# Altium project Stethescope.PrjPcb
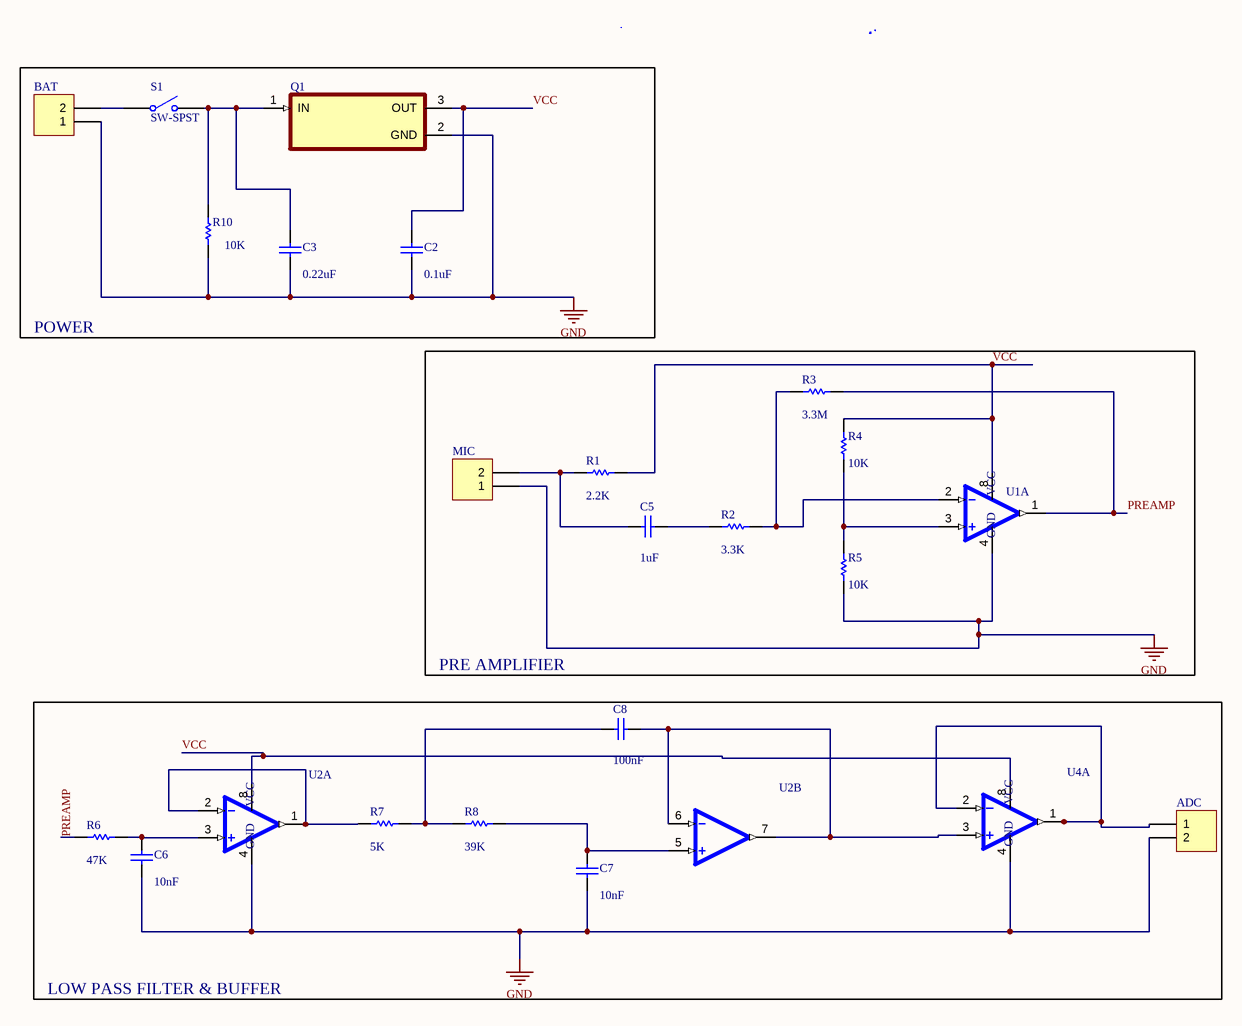
[diagram p0: Sheet1.SchDoc]
1 sheet, 23 parts. Net scope: global (net labels, ports and power ports of the same name join across sheets).
Board file: PCB1.PcbDoc

## Sheet Sheet1.SchDoc
size 420 x 297 mm; SheetNumber: 1; SheetTotal: 1

### Parts
ADC  MHDR1X2  [MHDR1X2]  (value not drawn)
BAT  MHDR1X2  [MHDR1X2]  (value not drawn)
C2  value 0.1uF  [RAD-0.3]  (hidden comment: Cap)
C3  value 0.22uF  [RAD-0.3]  (hidden comment: Cap)
C5  value 1uF  [RAD-0.3]  (hidden comment: Cap)
C6  value 10nF  [RAD-0.3]  (hidden comment: Cap)
C7  value 10nF  [RAD-0.3]  (hidden comment: Cap)
C8  value 100nF  [RAD-0.3]  (hidden comment: Cap)
MIC  MHDR1X2  [MHDR1X2]  (value not drawn)
Q1  LM7805CT/NOPB  [TO254P1054X470X1955-3]  (value not drawn)
R1  value 2.2K  [AXIAL-0.3]  (hidden comment: Res1)
R2  value 3.3K  [AXIAL-0.3]  (hidden comment: Res1)
R3  value 3.3M  [AXIAL-0.3]  (hidden comment: Res1)
R4  value 10K  [AXIAL-0.3]  (hidden comment: Res1)
R5  value 10K  [AXIAL-0.3]  (hidden comment: Res1)
R6  value 47K  [AXIAL-0.3]  (hidden comment: Res1)
R7  value 5K  [AXIAL-0.3]  (hidden comment: Res1)
R8  value 39K  [AXIAL-0.3]  (hidden comment: Res1)
R10  value 10K  [AXIAL-0.3]  (hidden comment: Res1)
S1  SW-SPST  [SPST-2]
U1  LM358N  [DIP762W46P254L960H508Q8]  (value not drawn)  (part A of 2)
U2  LM358N  [DIP762W46P254L960H508Q8]  (value not drawn)  (parts A,B of 2)
U4  LM358N  [DIP762W46P254L960H508Q8]  (value not drawn)  (part A of 2)

### Blocks framed on the sheet
POWER: BAT C2 C3 Q1 R10 S1
PRE AMPLIFIER: C5 MIC R1-R5 U1
LOW PASS FILTER & BUFFER: ADC C6-C8 R6-R8 U2 U4

### Nets
GND: ADC.2 BAT.1 C2.1 C3.1 C6.2 C7.2 MIC.1 Q1.2(GND) R5.1 R10.1 U1.4(GND) U2.4(GND) U4.4(GND)
PREAMP: R3.2 R6.1 U1.1(1OUT)
VCC: C2.2 Q1.3(OUT) R1.2 R4.2 U1.8(VCC) U2.8(VCC) U4.8(VCC)
NetADC_1: ADC.1 U4.1(1OUT) U4.2(1IN-)
NetBAT_2: BAT.2 S1.1(COMMON)
NetC3_2: C3.2 Q1.1(IN) R10.2 S1.2(NO)
NetC5_1: C5.1 R2.1
NetC5_2: C5.2 MIC.2 R1.1
NetC6_1: C6.1 R6.2 U2.3(1IN+)
NetC7_1: C7.1 R8.2 U2.5(2IN+)
NetC8_1: C8.1 U2.6(2IN-) U2.7(2OUT) U4.3(1IN+)
NetC8_2: C8.2 R7.2 R8.1
NetR2_2: R2.2 R3.1 U1.2(1IN-)
NetR4_1: R4.1 R5.2 U1.3(1IN+)
NetR7_1: R7.1 U2.1(1OUT) U2.2(1IN-)

### Notes on the sheet
- THIS DOCUMENT AND THE DATA DISCLOSED HEREIN OR
- HEREWITH IS THE PROPERTY OF ALTIUM LIMITED AND MAY
- DWG NO:
- REVISION
- REV:
- DESCRIPTION
- DATE
- APPROVED
- BE FREELY DISTRIBUTED IN WHOLE. NO RIGHTS ARE
- RESERVED OR EXPRESS OR IMPLIED WARANTEE GIVEN.
- ENG:
- APPROVALS
- PROJECT
- DSN:
- CHK:
- REFERENCE DOCUMENTS
- PROJECT REVISION:
- TITLE
- DOCUMENT REVISION:
- DESIGN ITEM:
- BOM:
- FAB DWG:
- PCB DWG:
- ASSY DWG:
- SCALE:
- A3
- SIZE
- CAGE CODE
- FILE NAME
- DWG NO.
- SHEET
- OF
- REV

### Library data of the parts
ADC BAT MIC = MHDR1X2: Header, 2-Pin; LatestRevisionDate: 17-Jul-2002; LatestRevisionNote: Re-released for DXP Platform.; Publisher: Altium Limited
C2 C3 C5-C8 = Cap: Capacitor; Published: 8-Jun-2000; LatestRevisionDate: 17-Jul-2002; LatestRevisionNote: Re-released for DXP Platform.; PackageReference: RAD-0.3; Publisher: Altium Limited; PackageDescription: Radial Cap, Thru-Hole; 2 Leads; 0.3 in Pin Spacing
R1-R8 R10 = Res1: Resistor; Published: 8-Jun-2000; LatestRevisionDate: 17-Jul-2002; LatestRevisionNote: Re-released for DXP Platform.; PackageReference: AXIAL-0.3; Publisher: Altium Limited; PackageDescription: Axial Device, Thru-Hole; 2 Leads; 0.3 in Pin Spacing
S1 = SW-SPST: Single-Pole, Single-Throw Switch; Published: 24-Mar-1999; LatestRevisionDate: 17-Jul-2002; LatestRevisionNote: Re-released for DXP Platform.; PackageReference: SPST-2; Publisher: Altium Limited; PackageDescription: Switch; 2 Leads
U1 U2 U4 = LM358N: General Purpose Amplifier 2 Circuit - 8-PDIP; MF: onsemi; SnapEDA_Link: https://www.snapeda.com/parts/LM358N/Onsemi/view-part/?ref=snap; Package: None; Value: *; MP: LM358N; Check_prices: https://www.snapeda.com/parts/LM358N/Onsemi/view-part/?ref=eda
Q1 = LM7805CT/NOPB: Price: None; MP: LM7805CT/NOPB; Availability: Unavailable; Value: *; Package: None